# Altium schematic sheet PLD_I2C-Repeater.SchDoc: I2C Repeater for RadFET
size A4; ApprovedBy: Piotr Kuligowski; CheckedBy: Piotr Kuligowski; Author: Michał Gumiela; SheetNumber: 8; SheetTotal: 13
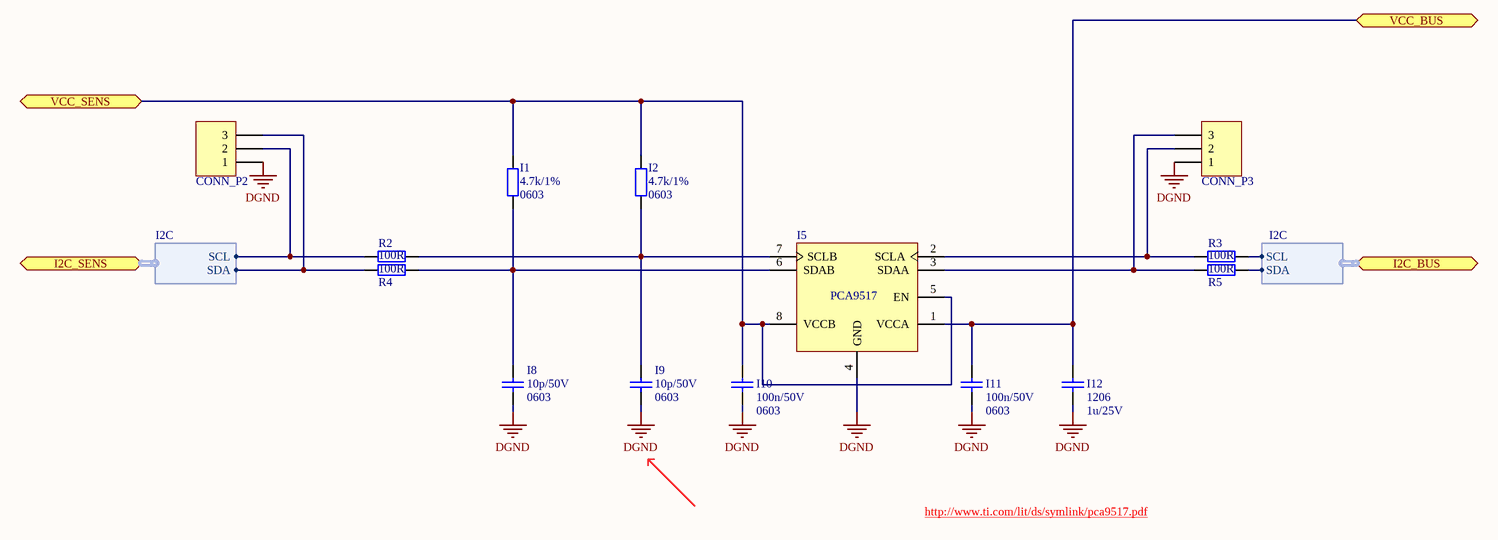
[diagram p0: PLD_I2C-Repeater.SchDoc]

## Parts
CONN_P2  Header 3  [HEADER 1X3 MALE]  (value not drawn)
CONN_P3  Header 3  [HEADER 1X3 MALE]  (value not drawn)
I1  Package: 0603  [SMD_Resistor_0603]  (hidden comment: 4.7k/1%)
I2  Package: 0603  [SMD_Resistor_0603]  (hidden comment: 4.7k/1%)
I5  PCA9517  [TSSOP8_L]
I8  Package: 0603  [SMD_Capacitor_0603]  (hidden comment: 10p/50V)
I9  Package: 0603  [SMD_Capacitor_0603]  (hidden comment: 10p/50V)
I10  Package: 0603  [SMD_Capacitor_0603]  (hidden comment: 100n/50V)
I11  Package: 0603  [SMD_Capacitor_0603]  (hidden comment: 100n/50V)
I12  Package: 1206  [SMD_Capacitor_1206]  (hidden comment: 1u/25V)
R2  100R  [SMD_Resistor_0603]
R3  100R  [SMD_Resistor_0603]
R4  100R  [SMD_Resistor_0603]
R5  100R  [SMD_Resistor_0603]

## Ports
I2C_BUS (harness I2C), I2C_SENS (harness I2C), VCC_BUS, VCC_SENS

## Harnesses
I2C: SDA, SCL

## Nets
DGND: CONN_P2.1 CONN_P3.1 I5.4(GND) I8.2 I9.2 I10.1 I11.1 I12.1
VCC_BUS: I5.1(VCCA) I11.2 I12.2 ; port VCC_BUS
VCC_SENS: I1.1 I2.1 I5.5(EN) I5.8(VCCB) I10.2 ; port VCC_SENS
NetCONN_P2_2: CONN_P2.2 R2.1 ; port I2C_SENS.SCL
NetCONN_P2_3: CONN_P2.3 R4.1 ; port I2C_SENS.SDA
NetCONN_P3_2: CONN_P3.2 I5.2(SCLA) R3.1
NetCONN_P3_3: CONN_P3.3 I5.3(SDAA) R5.1
NetI1_2: I1.2 I5.6(SDAB) I8.1 R4.2
NetI2_2: I2.2 I5.7(SCLB) I9.1 R2.2
NetR3_2: R3.2 ; port I2C_BUS.SCL
NetR5_2: R5.2 ; port I2C_BUS.SDA

## Notes on the sheet
- http://www.ti.com/lit/ds/symlink/pca9517.pdf
- Title:
- Project:
- Author:
- Model:
- Document Number:
- Checked by:
- Rev:
- Date:
- Approved by:
- Sheet:
- of
- File name:

## Library data of the parts
CONN_P2 CONN_P3 = Header 3: Header, 3-Pin; LatestRevisionDate: 17-Jul-2002; LatestRevisionNote: Re-released for DXP Platform.; Publisher: Altium Limited
I1 I2 = CRCW06034K70FKxxxx: 4.7k/1% Vishay CRCW 0603 Resistor. 100mW, 100ppm, 75V.; Manufacturer: Vishay; ManufactuerPartNumber: CRCW06034K70FKxxxx; Value: 4.7k/1%
I5 = PCA9517: Level-Translating I2C Bus Repeater; Manufacturer: Texas Instruments; ManufacturerPartNumber: PCA9517
I8 I9 = Cer_GCM1885C1H100JA16D: Ceramic Cap Murata Automotive 10p/50V C0G 0603; Manufacturer: Murata; ManufacturerPartNumber: GCM1885C1H100JA16D; Value: 10p/50V
I10 I11 = Cer_C0603T104K5RALTU: Ceramic Cap Kemet COTS 100n/50V X7R 0603; Manufacturer: Kemet; ManufacturerPartNumber: C0603T104K5RALTU; Value: 100n/50V
I12 = Cer_C1206T105K3RALTU: Ceramic Cap Kemet COTS 1u/25V X7R 1206; ManufacturerPartNumber: C1206T105K3RALTU; Manufacturer: Kemet; Value: 1u/25V
R2-R5 = Res: Value: 100R; Package: 0603